# EAGLE board FIRSTPRINT (EAGLE 9.6.2)
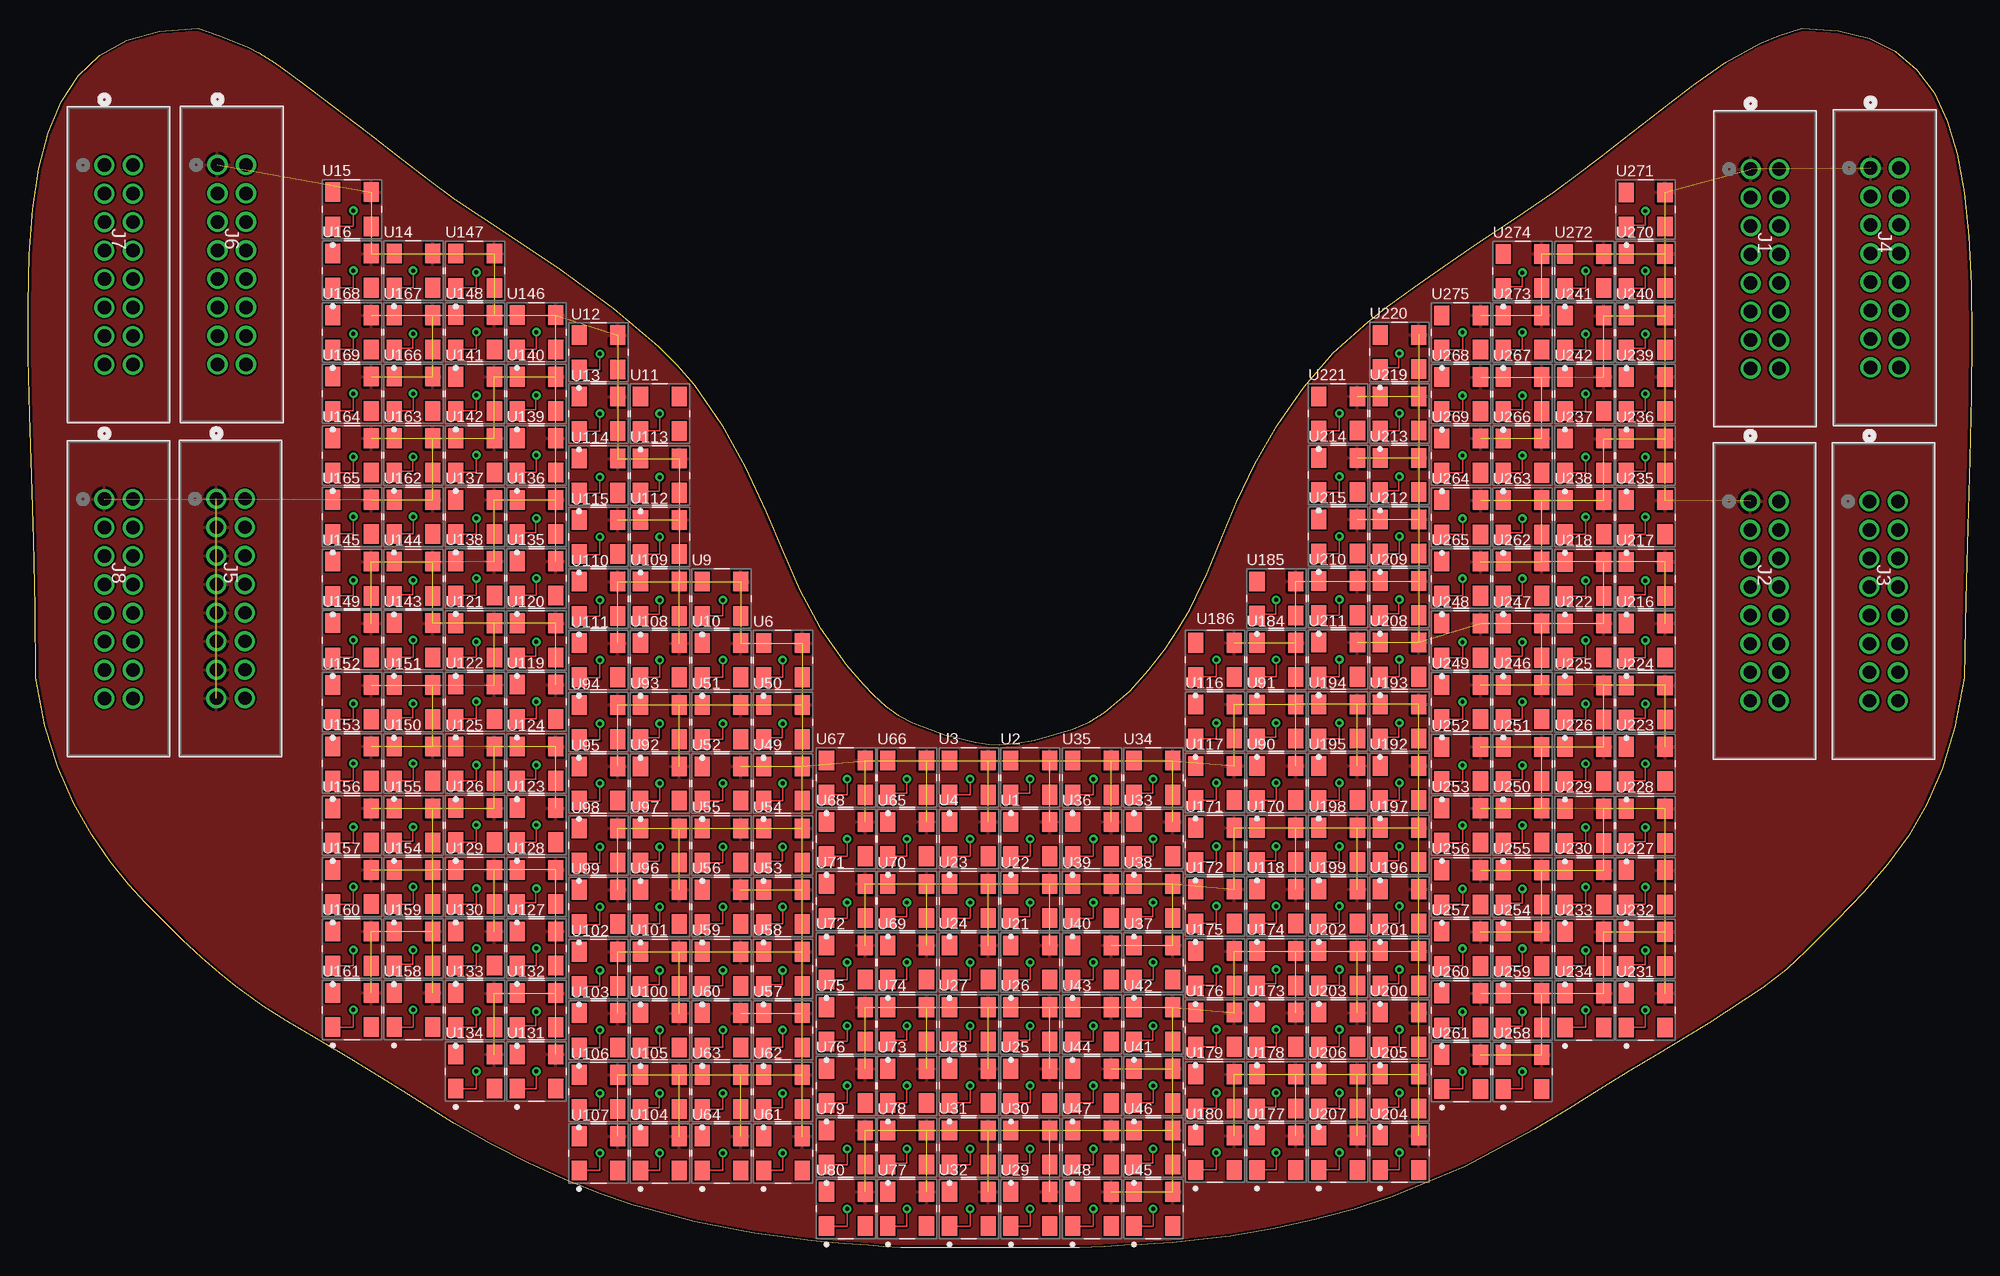
[diagram p9: board, top side]
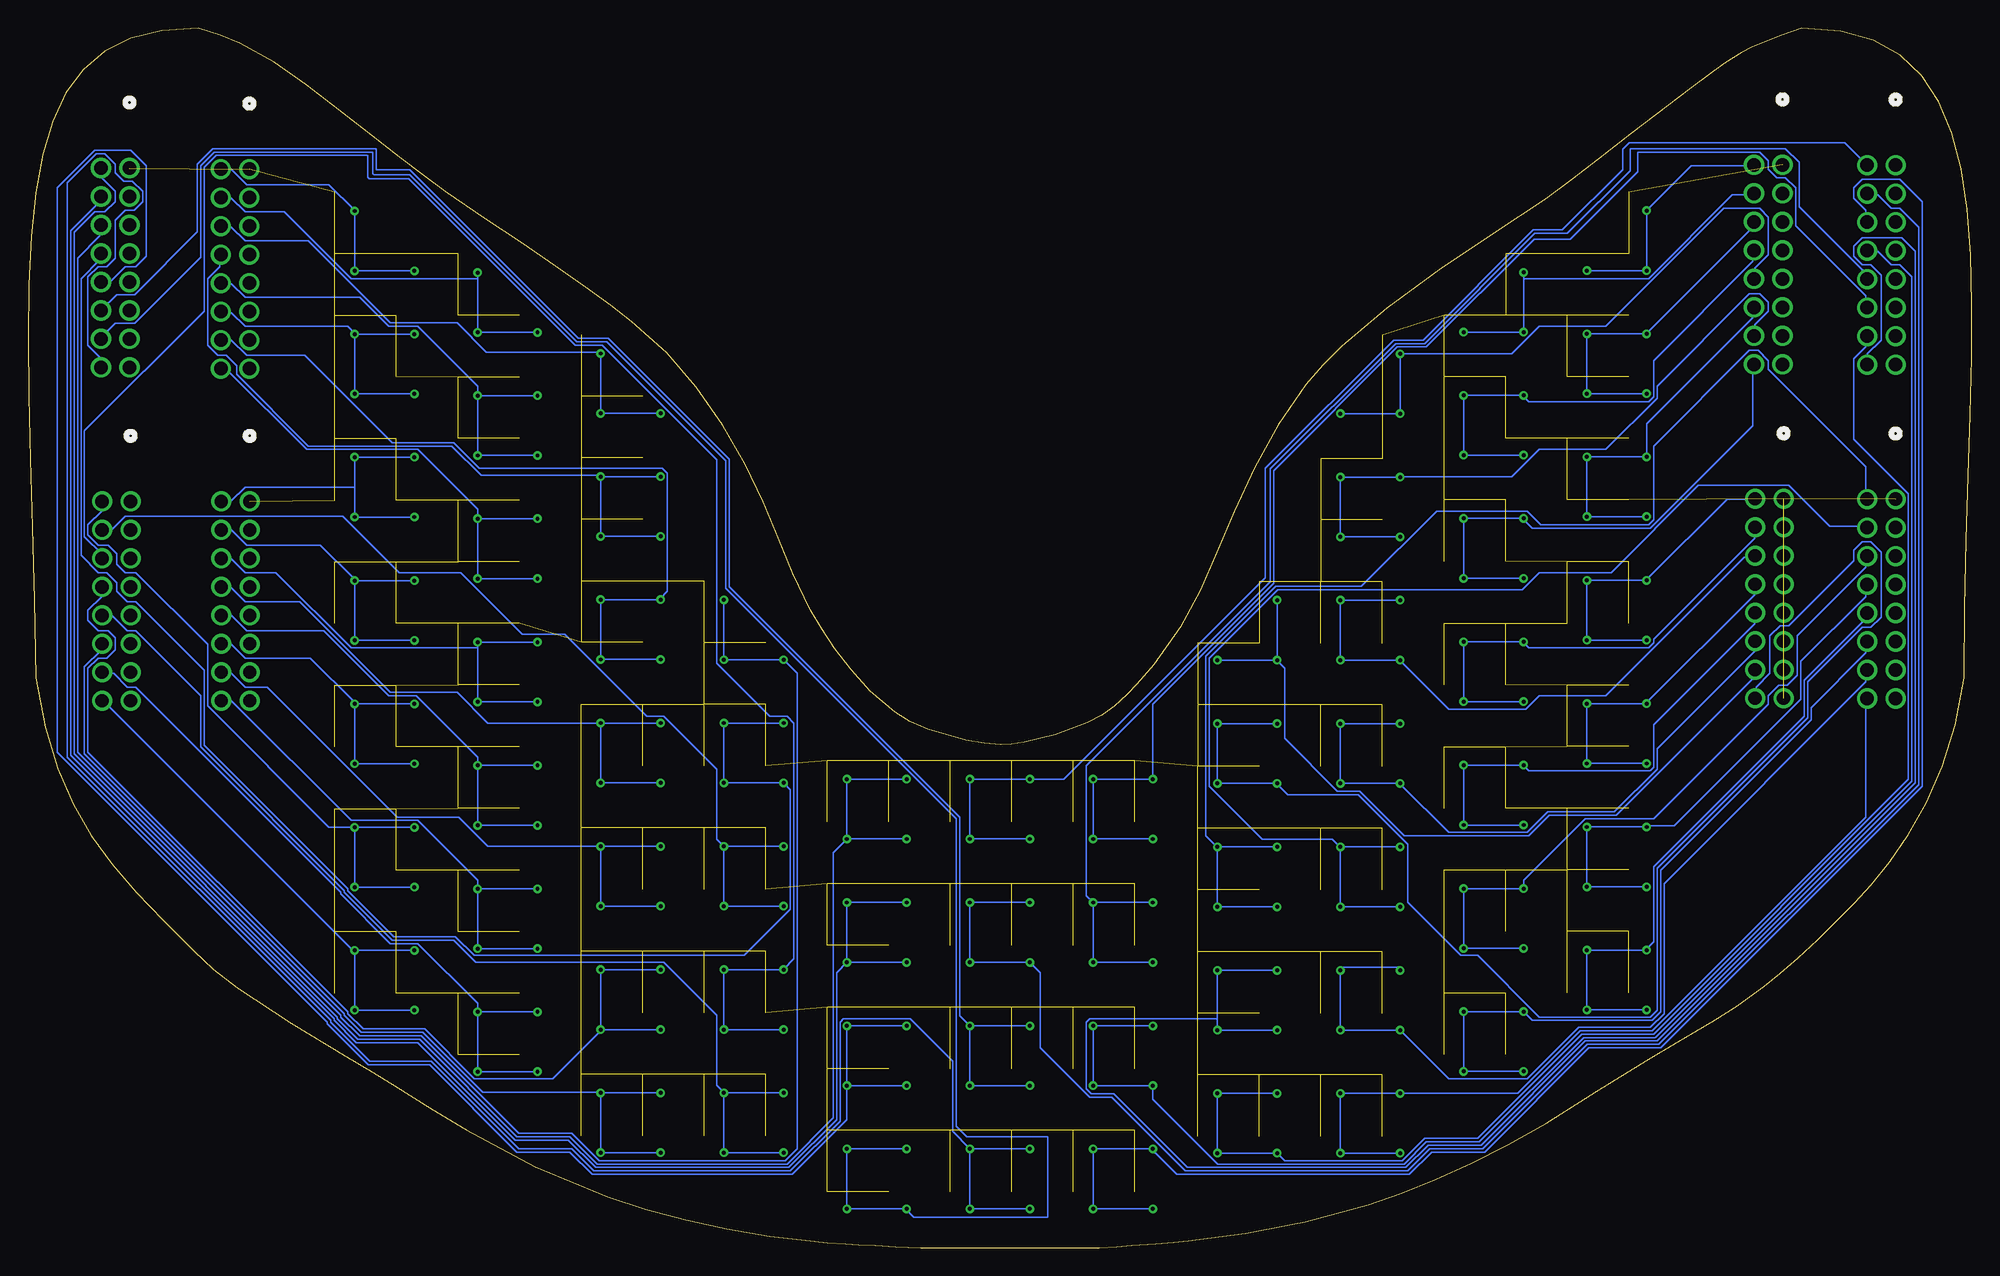
[diagram p10: board, bottom side, seen from below]

Size 173.3 x 108.74 mm. Coordinates in mm from the lower left corner, seen from the top.
Outline: 15.17,108.74 16.97,108.11 18.44,107.54 19.62,107.01 20.57,106.53 22,105.64 23.12,104.83 25.19,103.29 27.09,101.86 30.41,99.3 33.25,97.09 35.75,95.17 38.06,93.47 42.64,90.45 47.51,87.19 52.19,83.75 56.18,80.36 57.89,78.66 59.38,76.94 61.85,73.39 63.93,69.59 65.78,65.67 67.33,62.02 68.82,58.62 70.58,55.33 72.93,51.98 74.45,50.23 75.36,49.3 76.47,48.28 77.58,47.49 78.87,46.8 81.73,45.72 84.49,45.07 85.66,44.9 86.6,44.85 88.06,44.96 89.7,45.24 93.09,46.22 94.64,46.91 96,47.73 98.2,49.6 99.93,51.55 101.36,53.4 102.56,55.18 103.55,56.88 105.11,60.14 106.41,63.31 107.76,66.51 109.37,69.84 111.36,73.31 113.71,76.71 116.37,79.8 119.46,82.57 121.35,84.02 123.6,85.65 126.26,87.53 129.28,89.6 132.54,91.75 136.06,94.14 138,95.56 140.14,97.21 142.64,99.16 145.6,101.46 148.52,103.69 151.36,105.68 154.45,107.37 156.19,108.1 158.11,108.74 161.38,108.51 164.15,107.82 166.48,106.66 168.39,105.05 169.92,102.98 171.12,100.45 172.01,97.48 172.63,94.06 173.03,90.19 173.24,85.87 173.3,81.12 173.25,75.92 173.11,70.29 172.94,64.23 172.77,57.73 172.63,50.8 171.75,46.42 170.63,42.72 169.28,39.54 167.68,36.75 165.81,34.19 163.67,31.72 161.24,29.2 158.51,26.48 156.77,24.84 154.67,23.2 149.83,20.01 144.96,17.09 142.79,15.78 140.82,14.56 137.34,12.4 134.22,10.51 128.07,7.25 121.61,4.57 118.21,3.45 114.69,2.5 111.02,1.69 107.19,1.05 103.18,0.57 102.06,0.47 100.41,0.36 99.25,0.29 97.79,0.21 95.95,0.11 93.7,0 77.82,0 76.25,0.11 74.91,0.21 72.77,0.37 71.17,0.51 69.85,0.64 64.76,1.28 59.44,2.3 53.82,3.85 50.87,4.88 47.82,6.1 44.66,7.53 41.38,9.2 37.97,11.12 34.42,13.31 33.45,13.94 32.28,14.68 30.79,15.61 28.83,16.8 26.28,18.32 24.74,19.22 23,20.24 20.96,21.53 18.51,23.33 17.08,24.49 15.5,25.86 13.75,27.48 11.82,29.37 10.49,30.71 8.96,32.38 7.32,34.41 5.66,36.81 4.08,39.62 2.66,42.88 1.5,46.59 0.7,50.8 0.64,57.08 0.5,63.09 0.32,68.82 0.15,74.25 0.02,79.36 0,84.13 0.12,88.54 0.43,92.57 0.97,96.2 1.79,99.41 2.94,102.18 4.46,104.49 6.4,106.32 8.8,107.65 11.7,108.47 15.17,108.74
Copper layers (1*16): Top 0.035mm / dielectric 1.5mm / Bottom 0.035mm
Design rules "default *": minimum track width 6mil, minimum drill 0.35mm, track to track 6mil, track to pad 6mil, pad to pad 6mil, via to via 6mil, smd to smd 6mil, copper to edge 10mil, drill to drill 6mil, minimum pad ring 10mil, minimum via ring 8mil, stop-mask expansion 4mil, vias tented up to drill 0mil, thermal gap 10mil

## Footprints (pad centres in the part's own frame; a part is rotated, then mirrored left to right if it is on the bottom)
CONN_70246-1201_MOL = drill 1.194 pad 1.702: 1 0,0; 2 0,2.54; 3 2.54,0; 4 2.54,2.54; 5 5.08,0; 6 5.08,2.54; 7 7.62,0; 8 7.62,2.54; 9 10.16,0; 10 10.16,2.54; 11 12.7,0; 12 12.7,2.54; 13 15.24,0; 14 15.24,2.54; 15 17.78,0; 16 17.78,2.54
MURATA_MA40H1S-R_0 = smd 1.35 x 1.75: 1 -1.725,-1.525; 2 1.725,-1.525; 3 1.725,1.525; 4 -1.725,1.525

## Placement (x,y rotation side)
J1  70246-1201  [CONN_70246-1201_MOL]  153.57,96.16 270 top
J2  70246-1201  [CONN_70246-1201_MOL]  153.54,66.55 270 top
J3  70246-1201  [CONN_70246-1201_MOL]  164.16,66.55 270 top
J4  70246-1201  [CONN_70246-1201_MOL]  164.26,96.27 270 top
J5  70246-1201  [CONN_70246-1201_MOL]  16.79,66.78 270 top
J6  70246-1201  [CONN_70246-1201_MOL]  16.89,96.55 270 top
J7  70246-1201  [CONN_70246-1201_MOL]  6.8,96.52 270 top
J8  70246-1201  [CONN_70246-1201_MOL]  6.8,66.75 270 top
U1  MURATA_MA40H1S-RMURATA_MA40H1S-R_0_0  [MURATA_MA40H1S-R_0]  89.35,36.44 0 top
U2  MURATA_MA40H1S-RMURATA_MA40H1S-R_0_0  [MURATA_MA40H1S-R_0]  89.35,41.92 0 top
U3  MURATA_MA40H1S-RMURATA_MA40H1S-R_0_0  [MURATA_MA40H1S-R_0]  83.88,41.92 0 top
U4  MURATA_MA40H1S-RMURATA_MA40H1S-R_0_0  [MURATA_MA40H1S-R_0]  83.88,36.44 0 top
U6  MURATA_MA40H1S-RMURATA_MA40H1S-R_0_0  [MURATA_MA40H1S-R_0]  67.3,52.39 0 top
U9  MURATA_MA40H1S-RMURATA_MA40H1S-R_0_0  [MURATA_MA40H1S-R_0]  61.83,57.87 0 top
U10  MURATA_MA40H1S-RMURATA_MA40H1S-R_0_0  [MURATA_MA40H1S-R_0]  61.83,52.39 0 top
U11  MURATA_MA40H1S-RMURATA_MA40H1S-R_0_0  [MURATA_MA40H1S-R_0]  56.33,74.36 0 top
U12  MURATA_MA40H1S-RMURATA_MA40H1S-R_0_0  [MURATA_MA40H1S-R_0]  50.86,79.84 0 top
U13  MURATA_MA40H1S-RMURATA_MA40H1S-R_0_0  [MURATA_MA40H1S-R_0]  50.86,74.36 0 top
U14  MURATA_MA40H1S-RMURATA_MA40H1S-R_0_0  [MURATA_MA40H1S-R_0]  34.36,87.11 0 top
U15  MURATA_MA40H1S-RMURATA_MA40H1S-R_0_0  [MURATA_MA40H1S-R_0]  28.89,92.59 0 top
U16  MURATA_MA40H1S-RMURATA_MA40H1S-R_0_0  [MURATA_MA40H1S-R_0]  28.89,87.11 0 top
U21  MURATA_MA40H1S-RMURATA_MA40H1S-R_0_0  [MURATA_MA40H1S-R_0]  89.35,25.44 0 top
U22  MURATA_MA40H1S-RMURATA_MA40H1S-R_0_0  [MURATA_MA40H1S-R_0]  89.35,30.92 0 top
U23  MURATA_MA40H1S-RMURATA_MA40H1S-R_0_0  [MURATA_MA40H1S-R_0]  83.88,30.92 0 top
U24  MURATA_MA40H1S-RMURATA_MA40H1S-R_0_0  [MURATA_MA40H1S-R_0]  83.88,25.44 0 top
U25  MURATA_MA40H1S-RMURATA_MA40H1S-R_0_0  [MURATA_MA40H1S-R_0]  89.35,14.44 0 top
U26  MURATA_MA40H1S-RMURATA_MA40H1S-R_0_0  [MURATA_MA40H1S-R_0]  89.35,19.92 0 top
U27  MURATA_MA40H1S-RMURATA_MA40H1S-R_0_0  [MURATA_MA40H1S-R_0]  83.88,19.92 0 top
U28  MURATA_MA40H1S-RMURATA_MA40H1S-R_0_0  [MURATA_MA40H1S-R_0]  83.88,14.44 0 top
U29  MURATA_MA40H1S-RMURATA_MA40H1S-R_0_0  [MURATA_MA40H1S-R_0]  89.35,3.47 0 top
U30  MURATA_MA40H1S-RMURATA_MA40H1S-R_0_0  [MURATA_MA40H1S-R_0]  89.35,8.95 0 top
U31  MURATA_MA40H1S-RMURATA_MA40H1S-R_0_0  [MURATA_MA40H1S-R_0]  83.88,8.95 0 top
U32  MURATA_MA40H1S-RMURATA_MA40H1S-R_0_0  [MURATA_MA40H1S-R_0]  83.88,3.47 0 top
U33  MURATA_MA40H1S-RMURATA_MA40H1S-R_0_0  [MURATA_MA40H1S-R_0]  100.32,36.44 0 top
U34  MURATA_MA40H1S-RMURATA_MA40H1S-R_0_0  [MURATA_MA40H1S-R_0]  100.32,41.92 0 top
U35  MURATA_MA40H1S-RMURATA_MA40H1S-R_0_0  [MURATA_MA40H1S-R_0]  94.85,41.92 0 top
U36  MURATA_MA40H1S-RMURATA_MA40H1S-R_0_0  [MURATA_MA40H1S-R_0]  94.85,36.44 0 top
U37  MURATA_MA40H1S-RMURATA_MA40H1S-R_0_0  [MURATA_MA40H1S-R_0]  100.32,25.44 0 top
U38  MURATA_MA40H1S-RMURATA_MA40H1S-R_0_0  [MURATA_MA40H1S-R_0]  100.32,30.92 0 top
U39  MURATA_MA40H1S-RMURATA_MA40H1S-R_0_0  [MURATA_MA40H1S-R_0]  94.85,30.92 0 top
U40  MURATA_MA40H1S-RMURATA_MA40H1S-R_0_0  [MURATA_MA40H1S-R_0]  94.85,25.44 0 top
U41  MURATA_MA40H1S-RMURATA_MA40H1S-R_0_0  [MURATA_MA40H1S-R_0]  100.32,14.44 0 top
U42  MURATA_MA40H1S-RMURATA_MA40H1S-R_0_0  [MURATA_MA40H1S-R_0]  100.32,19.92 0 top
U43  MURATA_MA40H1S-RMURATA_MA40H1S-R_0_0  [MURATA_MA40H1S-R_0]  94.85,19.92 0 top
U44  MURATA_MA40H1S-RMURATA_MA40H1S-R_0_0  [MURATA_MA40H1S-R_0]  94.85,14.44 0 top
U45  MURATA_MA40H1S-RMURATA_MA40H1S-R_0_0  [MURATA_MA40H1S-R_0]  100.32,3.47 0 top
U46  MURATA_MA40H1S-RMURATA_MA40H1S-R_0_0  [MURATA_MA40H1S-R_0]  100.32,8.95 0 top
U47  MURATA_MA40H1S-RMURATA_MA40H1S-R_0_0  [MURATA_MA40H1S-R_0]  94.85,8.95 0 top
U48  MURATA_MA40H1S-RMURATA_MA40H1S-R_0_0  [MURATA_MA40H1S-R_0]  94.85,3.47 0 top
U49  MURATA_MA40H1S-RMURATA_MA40H1S-R_0_0  [MURATA_MA40H1S-R_0]  67.3,41.39 0 top
U50  MURATA_MA40H1S-RMURATA_MA40H1S-R_0_0  [MURATA_MA40H1S-R_0]  67.3,46.87 0 top
U51  MURATA_MA40H1S-RMURATA_MA40H1S-R_0_0  [MURATA_MA40H1S-R_0]  61.83,46.87 0 top
U52  MURATA_MA40H1S-RMURATA_MA40H1S-R_0_0  [MURATA_MA40H1S-R_0]  61.83,41.39 0 top
U53  MURATA_MA40H1S-RMURATA_MA40H1S-R_0_0  [MURATA_MA40H1S-R_0]  67.3,30.39 0 top
U54  MURATA_MA40H1S-RMURATA_MA40H1S-R_0_0  [MURATA_MA40H1S-R_0]  67.3,35.87 0 top
U55  MURATA_MA40H1S-RMURATA_MA40H1S-R_0_0  [MURATA_MA40H1S-R_0]  61.83,35.87 0 top
U56  MURATA_MA40H1S-RMURATA_MA40H1S-R_0_0  [MURATA_MA40H1S-R_0]  61.83,30.39 0 top
U57  MURATA_MA40H1S-RMURATA_MA40H1S-R_0_0  [MURATA_MA40H1S-R_0]  67.3,19.4 0 top
U58  MURATA_MA40H1S-RMURATA_MA40H1S-R_0_0  [MURATA_MA40H1S-R_0]  67.3,24.87 0 top
U59  MURATA_MA40H1S-RMURATA_MA40H1S-R_0_0  [MURATA_MA40H1S-R_0]  61.83,24.87 0 top
U60  MURATA_MA40H1S-RMURATA_MA40H1S-R_0_0  [MURATA_MA40H1S-R_0]  61.83,19.4 0 top
U61  MURATA_MA40H1S-RMURATA_MA40H1S-R_0_0  [MURATA_MA40H1S-R_0]  67.3,8.42 0 top
U62  MURATA_MA40H1S-RMURATA_MA40H1S-R_0_0  [MURATA_MA40H1S-R_0]  67.3,13.9 0 top
U63  MURATA_MA40H1S-RMURATA_MA40H1S-R_0_0  [MURATA_MA40H1S-R_0]  61.83,13.9 0 top
U64  MURATA_MA40H1S-RMURATA_MA40H1S-R_0_0  [MURATA_MA40H1S-R_0]  61.83,8.42 0 top
U65  MURATA_MA40H1S-RMURATA_MA40H1S-R_0_0  [MURATA_MA40H1S-R_0]  78.38,36.44 0 top
U66  MURATA_MA40H1S-RMURATA_MA40H1S-R_0_0  [MURATA_MA40H1S-R_0]  78.38,41.92 0 top
U67  MURATA_MA40H1S-RMURATA_MA40H1S-R_0_0  [MURATA_MA40H1S-R_0]  72.9,41.92 0 top
U68  MURATA_MA40H1S-RMURATA_MA40H1S-R_0_0  [MURATA_MA40H1S-R_0]  72.9,36.44 0 top
U69  MURATA_MA40H1S-RMURATA_MA40H1S-R_0_0  [MURATA_MA40H1S-R_0]  78.38,25.44 0 top
U70  MURATA_MA40H1S-RMURATA_MA40H1S-R_0_0  [MURATA_MA40H1S-R_0]  78.38,30.92 0 top
U71  MURATA_MA40H1S-RMURATA_MA40H1S-R_0_0  [MURATA_MA40H1S-R_0]  72.9,30.92 0 top
U72  MURATA_MA40H1S-RMURATA_MA40H1S-R_0_0  [MURATA_MA40H1S-R_0]  72.9,25.44 0 top
U73  MURATA_MA40H1S-RMURATA_MA40H1S-R_0_0  [MURATA_MA40H1S-R_0]  78.38,14.44 0 top
U74  MURATA_MA40H1S-RMURATA_MA40H1S-R_0_0  [MURATA_MA40H1S-R_0]  78.38,19.92 0 top
U75  MURATA_MA40H1S-RMURATA_MA40H1S-R_0_0  [MURATA_MA40H1S-R_0]  72.9,19.92 0 top
U76  MURATA_MA40H1S-RMURATA_MA40H1S-R_0_0  [MURATA_MA40H1S-R_0]  72.9,14.44 0 top
U77  MURATA_MA40H1S-RMURATA_MA40H1S-R_0_0  [MURATA_MA40H1S-R_0]  78.38,3.47 0 top
U78  MURATA_MA40H1S-RMURATA_MA40H1S-R_0_0  [MURATA_MA40H1S-R_0]  78.38,8.95 0 top
U79  MURATA_MA40H1S-RMURATA_MA40H1S-R_0_0  [MURATA_MA40H1S-R_0]  72.9,8.95 0 top
U80  MURATA_MA40H1S-RMURATA_MA40H1S-R_0_0  [MURATA_MA40H1S-R_0]  72.9,3.47 0 top
U90  MURATA_MA40H1S-RMURATA_MA40H1S-R_0_0  [MURATA_MA40H1S-R_0]  111.29,41.44 0 top
U91  MURATA_MA40H1S-RMURATA_MA40H1S-R_0_0  [MURATA_MA40H1S-R_0]  111.29,46.92 0 top
U92  MURATA_MA40H1S-RMURATA_MA40H1S-R_0_0  [MURATA_MA40H1S-R_0]  56.33,41.39 0 top
U93  MURATA_MA40H1S-RMURATA_MA40H1S-R_0_0  [MURATA_MA40H1S-R_0]  56.33,46.87 0 top
U94  MURATA_MA40H1S-RMURATA_MA40H1S-R_0_0  [MURATA_MA40H1S-R_0]  50.86,46.87 0 top
U95  MURATA_MA40H1S-RMURATA_MA40H1S-R_0_0  [MURATA_MA40H1S-R_0]  50.86,41.39 0 top
U96  MURATA_MA40H1S-RMURATA_MA40H1S-R_0_0  [MURATA_MA40H1S-R_0]  56.33,30.39 0 top
U97  MURATA_MA40H1S-RMURATA_MA40H1S-R_0_0  [MURATA_MA40H1S-R_0]  56.33,35.87 0 top
U98  MURATA_MA40H1S-RMURATA_MA40H1S-R_0_0  [MURATA_MA40H1S-R_0]  50.86,35.87 0 top
U99  MURATA_MA40H1S-RMURATA_MA40H1S-R_0_0  [MURATA_MA40H1S-R_0]  50.86,30.39 0 top
U100  MURATA_MA40H1S-RMURATA_MA40H1S-R_0_0  [MURATA_MA40H1S-R_0]  56.33,19.4 0 top
U101  MURATA_MA40H1S-RMURATA_MA40H1S-R_0_0  [MURATA_MA40H1S-R_0]  56.33,24.87 0 top
U102  MURATA_MA40H1S-RMURATA_MA40H1S-R_0_0  [MURATA_MA40H1S-R_0]  50.86,24.87 0 top
U103  MURATA_MA40H1S-RMURATA_MA40H1S-R_0_0  [MURATA_MA40H1S-R_0]  50.86,19.4 0 top
U104  MURATA_MA40H1S-RMURATA_MA40H1S-R_0_0  [MURATA_MA40H1S-R_0]  56.33,8.42 0 top
U105  MURATA_MA40H1S-RMURATA_MA40H1S-R_0_0  [MURATA_MA40H1S-R_0]  56.33,13.9 0 top
U106  MURATA_MA40H1S-RMURATA_MA40H1S-R_0_0  [MURATA_MA40H1S-R_0]  50.86,13.9 0 top
U107  MURATA_MA40H1S-RMURATA_MA40H1S-R_0_0  [MURATA_MA40H1S-R_0]  50.86,8.42 0 top
U108  MURATA_MA40H1S-RMURATA_MA40H1S-R_0_0  [MURATA_MA40H1S-R_0]  56.33,52.39 0 top
U109  MURATA_MA40H1S-RMURATA_MA40H1S-R_0_0  [MURATA_MA40H1S-R_0]  56.33,57.87 0 top
U110  MURATA_MA40H1S-RMURATA_MA40H1S-R_0_0  [MURATA_MA40H1S-R_0]  50.86,57.87 0 top
U111  MURATA_MA40H1S-RMURATA_MA40H1S-R_0_0  [MURATA_MA40H1S-R_0]  50.86,52.39 0 top
U112  MURATA_MA40H1S-RMURATA_MA40H1S-R_0_0  [MURATA_MA40H1S-R_0]  56.33,63.36 0 top
U113  MURATA_MA40H1S-RMURATA_MA40H1S-R_0_0  [MURATA_MA40H1S-R_0]  56.33,68.84 0 top
U114  MURATA_MA40H1S-RMURATA_MA40H1S-R_0_0  [MURATA_MA40H1S-R_0]  50.86,68.84 0 top
U115  MURATA_MA40H1S-RMURATA_MA40H1S-R_0_0  [MURATA_MA40H1S-R_0]  50.86,63.36 0 top
U116  MURATA_MA40H1S-RMURATA_MA40H1S-R_0_0  [MURATA_MA40H1S-R_0]  105.82,46.92 0 top
U117  MURATA_MA40H1S-RMURATA_MA40H1S-R_0_0  [MURATA_MA40H1S-R_0]  105.82,41.44 0 top
U118  MURATA_MA40H1S-RMURATA_MA40H1S-R_0_0  [MURATA_MA40H1S-R_0]  111.29,30.44 0 top
U119  MURATA_MA40H1S-RMURATA_MA40H1S-R_0_0  [MURATA_MA40H1S-R_0]  45.33,48.68 0 top
U120  MURATA_MA40H1S-RMURATA_MA40H1S-R_0_0  [MURATA_MA40H1S-R_0]  45.33,54.16 0 top
U121  MURATA_MA40H1S-RMURATA_MA40H1S-R_0_0  [MURATA_MA40H1S-R_0]  39.86,54.16 0 top
U122  MURATA_MA40H1S-RMURATA_MA40H1S-R_0_0  [MURATA_MA40H1S-R_0]  39.86,48.68 0 top
U123  MURATA_MA40H1S-RMURATA_MA40H1S-R_0_0  [MURATA_MA40H1S-R_0]  45.33,37.68 0 top
U124  MURATA_MA40H1S-RMURATA_MA40H1S-R_0_0  [MURATA_MA40H1S-R_0]  45.33,43.16 0 top
U125  MURATA_MA40H1S-RMURATA_MA40H1S-R_0_0  [MURATA_MA40H1S-R_0]  39.86,43.16 0 top
U126  MURATA_MA40H1S-RMURATA_MA40H1S-R_0_0  [MURATA_MA40H1S-R_0]  39.86,37.68 0 top
U127  MURATA_MA40H1S-RMURATA_MA40H1S-R_0_0  [MURATA_MA40H1S-R_0]  45.33,26.68 0 top
U128  MURATA_MA40H1S-RMURATA_MA40H1S-R_0_0  [MURATA_MA40H1S-R_0]  45.33,32.16 0 top
U129  MURATA_MA40H1S-RMURATA_MA40H1S-R_0_0  [MURATA_MA40H1S-R_0]  39.86,32.16 0 top
U130  MURATA_MA40H1S-RMURATA_MA40H1S-R_0_0  [MURATA_MA40H1S-R_0]  39.86,26.68 0 top
U131  MURATA_MA40H1S-RMURATA_MA40H1S-R_0_0  [MURATA_MA40H1S-R_0]  45.33,15.71 0 top
U132  MURATA_MA40H1S-RMURATA_MA40H1S-R_0_0  [MURATA_MA40H1S-R_0]  45.33,21.19 0 top
U133  MURATA_MA40H1S-RMURATA_MA40H1S-R_0_0  [MURATA_MA40H1S-R_0]  39.86,21.19 0 top
U134  MURATA_MA40H1S-RMURATA_MA40H1S-R_0_0  [MURATA_MA40H1S-R_0]  39.86,15.71 0 top
U135  MURATA_MA40H1S-RMURATA_MA40H1S-R_0_0  [MURATA_MA40H1S-R_0]  45.33,59.68 0 top
U136  MURATA_MA40H1S-RMURATA_MA40H1S-R_0_0  [MURATA_MA40H1S-R_0]  45.33,65.16 0 top
U137  MURATA_MA40H1S-RMURATA_MA40H1S-R_0_0  [MURATA_MA40H1S-R_0]  39.86,65.16 0 top
U138  MURATA_MA40H1S-RMURATA_MA40H1S-R_0_0  [MURATA_MA40H1S-R_0]  39.86,59.68 0 top
U139  MURATA_MA40H1S-RMURATA_MA40H1S-R_0_0  [MURATA_MA40H1S-R_0]  45.33,70.65 0 top
U140  MURATA_MA40H1S-RMURATA_MA40H1S-R_0_0  [MURATA_MA40H1S-R_0]  45.33,76.13 0 top
U141  MURATA_MA40H1S-RMURATA_MA40H1S-R_0_0  [MURATA_MA40H1S-R_0]  39.86,76.13 0 top
U142  MURATA_MA40H1S-RMURATA_MA40H1S-R_0_0  [MURATA_MA40H1S-R_0]  39.86,70.65 0 top
U143  MURATA_MA40H1S-RMURATA_MA40H1S-R_0_0  [MURATA_MA40H1S-R_0]  34.36,54.17 0 top
U144  MURATA_MA40H1S-RMURATA_MA40H1S-R_0_0  [MURATA_MA40H1S-R_0]  34.36,59.65 0 top
U145  MURATA_MA40H1S-RMURATA_MA40H1S-R_0_0  [MURATA_MA40H1S-R_0]  28.89,59.65 0 top
U146  MURATA_MA40H1S-RMURATA_MA40H1S-R_0_0  [MURATA_MA40H1S-R_0]  45.33,81.63 0 top
U147  MURATA_MA40H1S-RMURATA_MA40H1S-R_0_0  [MURATA_MA40H1S-R_0]  39.86,87.1 0 top
U148  MURATA_MA40H1S-RMURATA_MA40H1S-R_0_0  [MURATA_MA40H1S-R_0]  39.86,81.63 0 top
U149  MURATA_MA40H1S-RMURATA_MA40H1S-R_0_0  [MURATA_MA40H1S-R_0]  28.89,54.17 0 top
U150  MURATA_MA40H1S-RMURATA_MA40H1S-R_0_0  [MURATA_MA40H1S-R_0]  34.36,43.17 0 top
U151  MURATA_MA40H1S-RMURATA_MA40H1S-R_0_0  [MURATA_MA40H1S-R_0]  34.36,48.65 0 top
U152  MURATA_MA40H1S-RMURATA_MA40H1S-R_0_0  [MURATA_MA40H1S-R_0]  28.89,48.65 0 top
U153  MURATA_MA40H1S-RMURATA_MA40H1S-R_0_0  [MURATA_MA40H1S-R_0]  28.89,43.17 0 top
U154  MURATA_MA40H1S-RMURATA_MA40H1S-R_0_0  [MURATA_MA40H1S-R_0]  34.36,32.17 0 top
U155  MURATA_MA40H1S-RMURATA_MA40H1S-R_0_0  [MURATA_MA40H1S-R_0]  34.36,37.65 0 top
U156  MURATA_MA40H1S-RMURATA_MA40H1S-R_0_0  [MURATA_MA40H1S-R_0]  28.89,37.65 0 top
U157  MURATA_MA40H1S-RMURATA_MA40H1S-R_0_0  [MURATA_MA40H1S-R_0]  28.89,32.17 0 top
U158  MURATA_MA40H1S-RMURATA_MA40H1S-R_0_0  [MURATA_MA40H1S-R_0]  34.36,21.2 0 top
U159  MURATA_MA40H1S-RMURATA_MA40H1S-R_0_0  [MURATA_MA40H1S-R_0]  34.36,26.68 0 top
U160  MURATA_MA40H1S-RMURATA_MA40H1S-R_0_0  [MURATA_MA40H1S-R_0]  28.89,26.68 0 top
U161  MURATA_MA40H1S-RMURATA_MA40H1S-R_0_0  [MURATA_MA40H1S-R_0]  28.89,21.2 0 top
U162  MURATA_MA40H1S-RMURATA_MA40H1S-R_0_0  [MURATA_MA40H1S-R_0]  34.36,65.17 0 top
U163  MURATA_MA40H1S-RMURATA_MA40H1S-R_0_0  [MURATA_MA40H1S-R_0]  34.36,70.64 0 top
U164  MURATA_MA40H1S-RMURATA_MA40H1S-R_0_0  [MURATA_MA40H1S-R_0]  28.89,70.64 0 top
U165  MURATA_MA40H1S-RMURATA_MA40H1S-R_0_0  [MURATA_MA40H1S-R_0]  28.89,65.17 0 top
U166  MURATA_MA40H1S-RMURATA_MA40H1S-R_0_0  [MURATA_MA40H1S-R_0]  34.36,76.14 0 top
U167  MURATA_MA40H1S-RMURATA_MA40H1S-R_0_0  [MURATA_MA40H1S-R_0]  34.36,81.62 0 top
U168  MURATA_MA40H1S-RMURATA_MA40H1S-R_0_0  [MURATA_MA40H1S-R_0]  28.89,81.62 0 top
U169  MURATA_MA40H1S-RMURATA_MA40H1S-R_0_0  [MURATA_MA40H1S-R_0]  28.89,76.14 0 top
U170  MURATA_MA40H1S-RMURATA_MA40H1S-R_0_0  [MURATA_MA40H1S-R_0]  111.29,35.92 0 top
U171  MURATA_MA40H1S-RMURATA_MA40H1S-R_0_0  [MURATA_MA40H1S-R_0]  105.82,35.92 0 top
U172  MURATA_MA40H1S-RMURATA_MA40H1S-R_0_0  [MURATA_MA40H1S-R_0]  105.82,30.44 0 top
U173  MURATA_MA40H1S-RMURATA_MA40H1S-R_0_0  [MURATA_MA40H1S-R_0]  111.29,19.45 0 top
U174  MURATA_MA40H1S-RMURATA_MA40H1S-R_0_0  [MURATA_MA40H1S-R_0]  111.29,24.92 0 top
U175  MURATA_MA40H1S-RMURATA_MA40H1S-R_0_0  [MURATA_MA40H1S-R_0]  105.82,24.92 0 top
U176  MURATA_MA40H1S-RMURATA_MA40H1S-R_0_0  [MURATA_MA40H1S-R_0]  105.82,19.45 0 top
U177  MURATA_MA40H1S-RMURATA_MA40H1S-R_0_0  [MURATA_MA40H1S-R_0]  111.29,8.47 0 top
U178  MURATA_MA40H1S-RMURATA_MA40H1S-R_0_0  [MURATA_MA40H1S-R_0]  111.29,13.95 0 top
U179  MURATA_MA40H1S-RMURATA_MA40H1S-R_0_0  [MURATA_MA40H1S-R_0]  105.82,13.95 0 top
U180  MURATA_MA40H1S-RMURATA_MA40H1S-R_0_0  [MURATA_MA40H1S-R_0]  105.82,8.47 0 top
U184  MURATA_MA40H1S-RMURATA_MA40H1S-R_0_0  [MURATA_MA40H1S-R_0]  111.29,52.42 0 top
U185  MURATA_MA40H1S-RMURATA_MA40H1S-R_0_0  [MURATA_MA40H1S-R_0]  111.29,57.89 0 top
U186  MURATA_MA40H1S-RMURATA_MA40H1S-R_0_0  [MURATA_MA40H1S-R_0]  105.82,52.42 0 top
U192  MURATA_MA40H1S-RMURATA_MA40H1S-R_0_0  [MURATA_MA40H1S-R_0]  122.27,41.44 0 top
U193  MURATA_MA40H1S-RMURATA_MA40H1S-R_0_0  [MURATA_MA40H1S-R_0]  122.27,46.92 0 top
U194  MURATA_MA40H1S-RMURATA_MA40H1S-R_0_0  [MURATA_MA40H1S-R_0]  116.79,46.92 0 top
U195  MURATA_MA40H1S-RMURATA_MA40H1S-R_0_0  [MURATA_MA40H1S-R_0]  116.79,41.44 0 top
U196  MURATA_MA40H1S-RMURATA_MA40H1S-R_0_0  [MURATA_MA40H1S-R_0]  122.27,30.44 0 top
U197  MURATA_MA40H1S-RMURATA_MA40H1S-R_0_0  [MURATA_MA40H1S-R_0]  122.27,35.92 0 top
U198  MURATA_MA40H1S-RMURATA_MA40H1S-R_0_0  [MURATA_MA40H1S-R_0]  116.79,35.92 0 top
U199  MURATA_MA40H1S-RMURATA_MA40H1S-R_0_0  [MURATA_MA40H1S-R_0]  116.79,30.44 0 top
U200  MURATA_MA40H1S-RMURATA_MA40H1S-R_0_0  [MURATA_MA40H1S-R_0]  122.27,19.45 0 top
U201  MURATA_MA40H1S-RMURATA_MA40H1S-R_0_0  [MURATA_MA40H1S-R_0]  122.27,24.92 0 top
U202  MURATA_MA40H1S-RMURATA_MA40H1S-R_0_0  [MURATA_MA40H1S-R_0]  116.79,24.92 0 top
U203  MURATA_MA40H1S-RMURATA_MA40H1S-R_0_0  [MURATA_MA40H1S-R_0]  116.79,19.45 0 top
U204  MURATA_MA40H1S-RMURATA_MA40H1S-R_0_0  [MURATA_MA40H1S-R_0]  122.27,8.47 0 top
U205  MURATA_MA40H1S-RMURATA_MA40H1S-R_0_0  [MURATA_MA40H1S-R_0]  122.27,13.95 0 top
U206  MURATA_MA40H1S-RMURATA_MA40H1S-R_0_0  [MURATA_MA40H1S-R_0]  116.79,13.95 0 top
U207  MURATA_MA40H1S-RMURATA_MA40H1S-R_0_0  [MURATA_MA40H1S-R_0]  116.79,8.47 0 top
U208  MURATA_MA40H1S-RMURATA_MA40H1S-R_0_0  [MURATA_MA40H1S-R_0]  122.27,52.44 0 top
U209  MURATA_MA40H1S-RMURATA_MA40H1S-R_0_0  [MURATA_MA40H1S-R_0]  122.27,57.92 0 top
U210  MURATA_MA40H1S-RMURATA_MA40H1S-R_0_0  [MURATA_MA40H1S-R_0]  116.79,57.92 0 top
U211  MURATA_MA40H1S-RMURATA_MA40H1S-R_0_0  [MURATA_MA40H1S-R_0]  116.79,52.44 0 top
U212  MURATA_MA40H1S-RMURATA_MA40H1S-R_0_0  [MURATA_MA40H1S-R_0]  122.27,63.41 0 top
U213  MURATA_MA40H1S-RMURATA_MA40H1S-R_0_0  [MURATA_MA40H1S-R_0]  122.27,68.89 0 top
U214  MURATA_MA40H1S-RMURATA_MA40H1S-R_0_0  [MURATA_MA40H1S-R_0]  116.79,68.89 0 top
U215  MURATA_MA40H1S-RMURATA_MA40H1S-R_0_0  [MURATA_MA40H1S-R_0]  116.79,63.41 0 top
U216  MURATA_MA40H1S-RMURATA_MA40H1S-R_0_0  [MURATA_MA40H1S-R_0]  144.21,54.14 0 top
U217  MURATA_MA40H1S-RMURATA_MA40H1S-R_0_0  [MURATA_MA40H1S-R_0]  144.21,59.62 0 top
U218  MURATA_MA40H1S-RMURATA_MA40H1S-R_0_0  [MURATA_MA40H1S-R_0]  138.74,59.62 0 top
U219  MURATA_MA40H1S-RMURATA_MA40H1S-R_0_0  [MURATA_MA40H1S-R_0]  122.27,74.39 0 top
U220  MURATA_MA40H1S-RMURATA_MA40H1S-R_0_0  [MURATA_MA40H1S-R_0]  122.27,79.86 0 top
U221  MURATA_MA40H1S-RMURATA_MA40H1S-R_0_0  [MURATA_MA40H1S-R_0]  116.79,74.39 0 top
U222  MURATA_MA40H1S-RMURATA_MA40H1S-R_0_0  [MURATA_MA40H1S-R_0]  138.74,54.14 0 top
U223  MURATA_MA40H1S-RMURATA_MA40H1S-R_0_0  [MURATA_MA40H1S-R_0]  144.21,43.14 0 top
U224  MURATA_MA40H1S-RMURATA_MA40H1S-R_0_0  [MURATA_MA40H1S-R_0]  144.21,48.62 0 top
U225  MURATA_MA40H1S-RMURATA_MA40H1S-R_0_0  [MURATA_MA40H1S-R_0]  138.74,48.62 0 top
U226  MURATA_MA40H1S-RMURATA_MA40H1S-R_0_0  [MURATA_MA40H1S-R_0]  138.74,43.14 0 top
U227  MURATA_MA40H1S-RMURATA_MA40H1S-R_0_0  [MURATA_MA40H1S-R_0]  144.21,32.15 0 top
U228  MURATA_MA40H1S-RMURATA_MA40H1S-R_0_0  [MURATA_MA40H1S-R_0]  144.21,37.62 0 top
U229  MURATA_MA40H1S-RMURATA_MA40H1S-R_0_0  [MURATA_MA40H1S-R_0]  138.74,37.62 0 top
U230  MURATA_MA40H1S-RMURATA_MA40H1S-R_0_0  [MURATA_MA40H1S-R_0]  138.74,32.15 0 top
U231  MURATA_MA40H1S-RMURATA_MA40H1S-R_0_0  [MURATA_MA40H1S-R_0]  144.21,21.17 0 top
U232  MURATA_MA40H1S-RMURATA_MA40H1S-R_0_0  [MURATA_MA40H1S-R_0]  144.21,26.65 0 top
U233  MURATA_MA40H1S-RMURATA_MA40H1S-R_0_0  [MURATA_MA40H1S-R_0]  138.74,26.65 0 top
U234  MURATA_MA40H1S-RMURATA_MA40H1S-R_0_0  [MURATA_MA40H1S-R_0]  138.74,21.17 0 top
U235  MURATA_MA40H1S-RMURATA_MA40H1S-R_0_0  [MURATA_MA40H1S-R_0]  144.21,65.14 0 top
U236  MURATA_MA40H1S-RMURATA_MA40H1S-R_0_0  [MURATA_MA40H1S-R_0]  144.21,70.62 0 top
U237  MURATA_MA40H1S-RMURATA_MA40H1S-R_0_0  [MURATA_MA40H1S-R_0]  138.74,70.62 0 top
U238  MURATA_MA40H1S-RMURATA_MA40H1S-R_0_0  [MURATA_MA40H1S-R_0]  138.74,65.14 0 top
U239  MURATA_MA40H1S-RMURATA_MA40H1S-R_0_0  [MURATA_MA40H1S-R_0]  144.21,76.11 0 top
U240  MURATA_MA40H1S-RMURATA_MA40H1S-R_0_0  [MURATA_MA40H1S-R_0]  144.21,81.59 0 top
U241  MURATA_MA40H1S-RMURATA_MA40H1S-R_0_0  [MURATA_MA40H1S-R_0]  138.74,81.59 0 top
U242  MURATA_MA40H1S-RMURATA_MA40H1S-R_0_0  [MURATA_MA40H1S-R_0]  138.74,76.11 0 top
U246  MURATA_MA40H1S-RMURATA_MA40H1S-R_0_0  [MURATA_MA40H1S-R_0]  133.24,48.66 0 top
U247  MURATA_MA40H1S-RMURATA_MA40H1S-R_0_0  [MURATA_MA40H1S-R_0]  133.24,54.13 0 top
U248  MURATA_MA40H1S-RMURATA_MA40H1S-R_0_0  [MURATA_MA40H1S-R_0]  127.77,54.13 0 top
U249  MURATA_MA40H1S-RMURATA_MA40H1S-R_0_0  [MURATA_MA40H1S-R_0]  127.77,48.66 0 top
U250  MURATA_MA40H1S-RMURATA_MA40H1S-R_0_0  [MURATA_MA40H1S-R_0]  133.24,37.66 0 top
U251  MURATA_MA40H1S-RMURATA_MA40H1S-R_0_0  [MURATA_MA40H1S-R_0]  133.24,43.14 0 top
U252  MURATA_MA40H1S-RMURATA_MA40H1S-R_0_0  [MURATA_MA40H1S-R_0]  127.77,43.14 0 top
U253  MURATA_MA40H1S-RMURATA_MA40H1S-R_0_0  [MURATA_MA40H1S-R_0]  127.77,37.66 0 top
U254  MURATA_MA40H1S-RMURATA_MA40H1S-R_0_0  [MURATA_MA40H1S-R_0]  133.24,26.66 0 top
U255  MURATA_MA40H1S-RMURATA_MA40H1S-R_0_0  [MURATA_MA40H1S-R_0]  133.24,32.14 0 top
U256  MURATA_MA40H1S-RMURATA_MA40H1S-R_0_0  [MURATA_MA40H1S-R_0]  127.77,32.14 0 top
U257  MURATA_MA40H1S-RMURATA_MA40H1S-R_0_0  [MURATA_MA40H1S-R_0]  127.77,26.66 0 top
U258  MURATA_MA40H1S-RMURATA_MA40H1S-R_0_0  [MURATA_MA40H1S-R_0]  133.24,15.69 0 top
U259  MURATA_MA40H1S-RMURATA_MA40H1S-R_0_0  [MURATA_MA40H1S-R_0]  133.24,21.16 0 top
U260  MURATA_MA40H1S-RMURATA_MA40H1S-R_0_0  [MURATA_MA40H1S-R_0]  127.77,21.16 0 top
U261  MURATA_MA40H1S-RMURATA_MA40H1S-R_0_0  [MURATA_MA40H1S-R_0]  127.77,15.69 0 top
U262  MURATA_MA40H1S-RMURATA_MA40H1S-R_0_0  [MURATA_MA40H1S-R_0]  133.24,59.65 0 top
U263  MURATA_MA40H1S-RMURATA_MA40H1S-R_0_0  [MURATA_MA40H1S-R_0]  133.24,65.13 0 top
U264  MURATA_MA40H1S-RMURATA_MA40H1S-R_0_0  [MURATA_MA40H1S-R_0]  127.77,65.13 0 top
U265  MURATA_MA40H1S-RMURATA_MA40H1S-R_0_0  [MURATA_MA40H1S-R_0]  127.77,59.65 0 top
U266  MURATA_MA40H1S-RMURATA_MA40H1S-R_0_0  [MURATA_MA40H1S-R_0]  133.24,70.63 0 top
U267  MURATA_MA40H1S-RMURATA_MA40H1S-R_0_0  [MURATA_MA40H1S-R_0]  133.24,76.1 0 top
U268  MURATA_MA40H1S-RMURATA_MA40H1S-R_0_0  [MURATA_MA40H1S-R_0]  127.77,76.1 0 top
U269  MURATA_MA40H1S-RMURATA_MA40H1S-R_0_0  [MURATA_MA40H1S-R_0]  127.77,70.63 0 top
U270  MURATA_MA40H1S-RMURATA_MA40H1S-R_0_0  [MURATA_MA40H1S-R_0]  144.21,87.09 0 top
U271  MURATA_MA40H1S-RMURATA_MA40H1S-R_0_0  [MURATA_MA40H1S-R_0]  144.21,92.56 0 top
U272  MURATA_MA40H1S-RMURATA_MA40H1S-R_0_0  [MURATA_MA40H1S-R_0]  138.74,87.09 0 top
U273  MURATA_MA40H1S-RMURATA_MA40H1S-R_0_0  [MURATA_MA40H1S-R_0]  133.24,81.6 0 top
U274  MURATA_MA40H1S-RMURATA_MA40H1S-R_0_0  [MURATA_MA40H1S-R_0]  133.24,87.08 0 top
U275  MURATA_MA40H1S-RMURATA_MA40H1S-R_0_0  [MURATA_MA40H1S-R_0]  127.77,81.6 0 top

## Tracks (layer width: path | path; a pad name or v marks a point on that pad's centre or on a via)
GND  (259 unrouted)
  pour Top: -1.98,110.08 -1.98,38.58 42.11,-5.51 127.45,-5.51 131.52,-1.45 133.86,-1.45 181.84,46.53 181.84,103.38 178.48,106.73 170.56,114.66 166.75,114.66 4.98,114.66 -1.02,108.66
N$1  (via drill 0.35)
  Top 0.152: U3.1 84,40.39 v84,41.78 | v89.33,41.78 89.3,41.75 89.3,40.51 87.75,40.51 U2.1 | U4.1 84,34.91 v84,36.45 | U1.1 89.33,34.91 89.33,36.3 | 89.33,36.3 | 89.33,36.3 v89.33,36.45
  Bottom 0.152: v84,36.45 v89.33,36.45 v89.33,41.78 v84,41.78 v83.99,41.78 80.95,41.78 63,59.73 63,69.48 51.56,80.92 48.92,80.92 39.1,90.74 36.51,90.74 31.14,96.11 31.14,97.94 30.55,98.53 11.35,98.53 J7.2
N$3  (via drill 0.35)
  Top 0.152: U9.1 61.95,56.34 v61.95,57.73 | U10.1 61.95,50.87 v61.95,52.4 | U6.1 67.28,50.87 v67.28,52.4
  Bottom 0.152: v67.28,52.4 v61.95,52.4 | v61.95,52.4 v61.95,57.73 | J5.14 19.38,51.51 19.38,50.9 31.72,38.56 37.67,38.56 39.49,36.73 50.62,36.73 54.58,40.69 56.56,40.69 61.29,45.41 61.29,51.66 61.9,52.27 v61.95,52.4
N$5  (via drill 0.35)
  Top 0.152: U15.1 29,91.06 v29,92.46 | U16.1 29,85.59 v29,87.12 | U14.1 34.34,85.59 v34.34,87.12
  Bottom 0.152: v34.34,87.12 v29,87.12 v29,92.46 28.98,92.51 25.02,96.47 19.53,96.47 J6.2
N$6  (via drill 0.35)
  Top 0.152: U23.1 84,29.39 v84,30.79 | v89.33,30.79 89.3,30.75 89.3,29.52 87.75,29.52 U22.1 | U24.1 84,23.91 v84,25.45 | U21.1 89.33,23.91 v89.33,25.45
  Bottom 0.152: v84,30.79 v89.33,30.79 v89.33,25.45 v84,25.45 83.08,24.54 83.08,17.83 78.66,13.41 76.68,13.41 70.13,6.86 50.31,6.86 48.33,8.84 43.61,8.84 34.31,18.14 27.91,18.14 4.75,41.3 4.75,90.98 6.42,92.66 7.19,92.66 8.41,93.88 9.32,93.88 J7.4
N$7  (via drill 0.35)
  Top 0.152: U27.1 84,18.39 v84,19.79 | v89.33,19.79 89.3,19.76 89.3,18.52 87.75,18.52 U26.1 | U28.1 84,12.92 v84,14.45 | U25.1 89.33,12.92 v89.33,14.45
  Bottom 0.152: v89.33,19.79 v84,19.79 | v89.33,19.79 v89.33,14.45 v84,14.45 | J4.12 165.38,84.98 163.79,84.98 158.21,90.56 158.21,96.59 156.82,97.99 142.26,97.99 142.26,96.1 139.28,96.1 124.26,81.08 121.56,81.08 110.79,70.31 110.79,58.93 90.24,38.38 90.24,20.7 v89.33,19.79
N$8  (via drill 0.35)
  Top 0.152: U31.1 84,7.42 v84,8.81 | v89.33,8.81 89.3,8.78 89.3,7.54 87.75,7.54 U30.1 | U32.1 84,1.94 v84,3.48 | U29.1 89.33,1.94 v89.33,3.48
  Bottom 0.152: v89.33,8.81 v84,8.81 | v89.33,8.81 v89.33,3.48 v84,3.48 | J4.16 166.9,78.49 166.9,79.4 167.97,80.47 167.97,86.56 167.05,87.48 166.29,87.48 165.53,88.24 165.53,91.59 164.61,92.51 163.85,92.51 163.09,93.27 163.09,94.18 164,95.1 164.77,95.1 165.53,95.86 165.53,96.62 166.44,97.54 167.21,97.54 169.8,94.94 169.8,43.74 146.33,20.27 146.33,20.12 142.82,16.61 137.33,16.61 129.56,8.84 124.84,8.84 122.86,6.86 105.33,6.86 100.91,11.28 100.91,20.12 100.61,20.42 94.66,20.42 90.88,16.64 90.88,10.39 89.33,8.84 v89.33,8.81
N$9  (via drill 0.35)
  Top 0.152: U35.1 94.97,40.39 v94.97,41.78 | v100.3,41.78 100.27,41.75 100.27,40.51 98.72,40.51 U34.1 | U36.1 94.97,34.91 v94.97,36.45 | U33.1 100.3,34.91 v100.3,36.45
  Bottom 0.152: v94.97,41.78 v100.3,41.78 v100.3,36.45 | v100.3,36.45 v94.97,36.45 | J4.2 166.75,96.16 166.75,95.4 165.53,94.18 165.53,93.27 166.44,92.35 167.36,92.35 169.19,90.53 169.19,44.04 145.72,20.57 145.72,20.42 143.89,18.59 138.4,18.59 129.71,9.91 124.99,9.91 122.55,7.47 105.64,7.47 101.52,11.58 101.52,35.2 100.3,36.42 v100.3,36.45
N$10  (via drill 0.35)
  Top 0.152: U43.1 94.97,18.39 v94.97,19.79 | v100.3,19.79 100.27,19.76 100.27,18.52 98.72,18.52 U42.1 | U44.1 94.97,12.92 v94.97,14.45 | U41.1 100.3,12.92 v100.3,14.45
  Bottom 0.152: v94.97,19.79 v100.3,19.79 v100.3,14.45 | v100.3,14.45 v94.97,14.45 | J4.10 165.99,86.11 164.61,87.48 163.7,87.48 162.79,88.39 162.79,96.47 164.16,97.84 167.36,97.84 170.71,94.49 170.71,44.2 146.63,20.12 146.63,19.96 142.97,16.31 137.49,16.31 129.71,8.53 124.99,8.53 123.01,6.55 105.18,6.55 100.3,11.43 v100.3,14.45
N$11  (via drill 0.35)
  Top 0.152: U39.1 94.97,29.39 v94.97,30.79 | v100.3,30.79 100.27,30.75 100.27,29.52 98.72,29.52 U38.1 | U40.1 94.97,23.91 v94.97,25.45 | U37.1 100.3,23.91 v100.3,25.45
  Bottom 0.152: v94.97,30.79 v100.3,30.79 v100.3,25.45 | v100.3,25.45 v94.97,25.45 | v100.3,25.45 101.22,24.54 101.22,11.43 105.48,7.16 122.7,7.16 125.14,9.6 129.87,9.6 138.55,18.29 144.04,18.29 146.02,20.27 146.02,20.42 169.49,43.89 169.49,90.68 166.9,93.27 166.9,93.73 J4.4
N$12  (via drill 0.35)
  Top 0.152: U47.1 94.97,7.42 v94.97,8.81 | v100.3,8.81 100.27,8.78 100.27,7.54 98.72,7.54 U46.1 | U48.1 94.97,1.94 v94.97,3.48 | U45.1 100.3,1.94 v100.3,3.48
  Bottom 0.152: v94.97,8.81 v100.3,8.81 v100.3,3.48 v94.97,3.48 94.97,3.35 94.36,2.74 82.42,2.74 82.39,2.77 82.39,9.88 89.61,9.88 90.55,10.82 90.55,38.25 111.1,58.8 111.1,70.18 121.69,80.77 124.38,80.77 139.25,95.64 142.45,95.64 142.57,95.76 142.57,97.69 142.74,97.69 156.69,97.69 157.91,96.47 157.91,88.32 163.4,82.83 163.79,82.44 165.51,82.44 166.75,81.2 166.75,81.08 J4.14
N$13  (via drill 0.35)
  Top 0.152: U51.1 61.95,45.34 v61.95,46.74 | v67.28,46.74 67.25,46.71 67.25,45.47 65.7,45.47 U50.1 | U52.1 61.95,39.87 v61.95,41.4 | U49.1 67.28,39.87 v67.28,41.4
  Bottom 0.152: v61.95,46.74 v67.28,46.74 v67.28,41.4 v61.95,41.4 61.9,41.3 60.98,40.39 54.73,40.39 50.31,35.97 50.31,30.79 45.59,26.06 44.07,26.06 38.58,20.57 28.67,20.57 28.06,21.18 28.06,33.83 14.65,47.24 14.65,50.44 9.78,55.32 9.01,55.32 8.1,56.24 8.1,62.03 9.01,62.94 9.78,62.94 10.54,62.18 10.54,61.27 16.33,55.47 17.09,55.47 18.01,54.56 18.01,51.21 19.23,49.99 19.23,49.07 J5.16
N$14  (via drill 0.35)
  Top 0.152: U55.1 61.95,34.35 v61.95,35.74 | v67.28,35.74 67.25,35.71 67.25,34.47 65.7,34.47 U54.1 | U56.1 61.95,28.87 v61.95,30.4 | U53.1 67.28,28.87 v67.28,30.4
  Bottom 0.152: v67.28,35.74 v61.95,35.74 | v67.28,35.74 v67.28,30.4 v61.95,30.4 | J8.2 9.47,66.75 9.47,69.65 18.16,78.33 18.16,79.1 19.07,80.01 19.84,80.01 28.37,71.48 28.37,64.92 28.83,64.47 38.43,64.47 39.65,65.68 47.72,65.68 54.43,58.98 62.05,58.98 68.3,52.73 68.3,36.73 67.38,35.81 v67.28,35.74
N$15  (via drill 0.35)
  Top 0.152: U59.1 61.95,23.35 v61.95,24.74 | v67.28,24.74 67.25,24.71 67.25,23.47 65.7,23.47 U58.1 | U60.1 61.95,17.87 v61.95,19.41 | U57.1 67.28,17.87 v67.28,19.41
  Bottom 0.152: v61.95,24.74 v67.28,24.74 67.28,20.42 | 67.28,20.42 v67.28,19.41 v61.95,19.41 | 67.28,20.42 78.66,20.42 78.97,20.12 78.97,14.17 78.51,13.72 76.53,13.72 69.97,7.16 50.47,7.16 48.49,9.14 43.76,9.14 34.47,18.44 28.06,18.44 5.05,41.45 5.05,88.85 6.27,90.07 9.78,90.07 10.54,89.31 10.54,88.39 9.78,87.63 9.01,87.63 8.1,86.72 8.1,80.92 9.32,79.7 9.32,78.79 J7.16
N$16  (via drill 0.35)
  Top 0.152: U63.1 61.95,12.38 v61.95,13.77 | v67.28,13.77 67.25,13.74 67.25,12.5 65.7,12.5 U62.1 | U64.1 61.95,6.9 v61.95,8.43 | U61.1 67.28,6.9 v67.28,8.43
  Bottom 0.152: v61.95,13.77 v67.28,13.77 v67.28,8.43 v61.95,8.43 61.29,7.77 50.77,7.77 48.79,9.75 44.07,9.75 34.77,19.05 28.37,19.05 5.66,41.76 5.66,67.21 10.54,72.08 10.54,79.25 9.47,80.31 9.47,81.23 J7.14
N$18  (via drill 0.35)
  Top 0.152: U71.1 73.02,29.39 v73.02,30.79 | v78.36,30.79 78.33,30.75 78.33,29.52 76.77,29.52 U70.1 | U72.1 73.02,23.91 v73.02,25.45 | U69.1 78.36,23.91 v78.36,25.45
  Bottom 0.152: v78.36,30.79 v73.02,30.79 | v78.36,30.79 v78.36,25.45 v73.02,25.45 | v78.36,30.79 78.97,31.39 78.97,42.98 62.56,59.38 62.56,69.44 51.38,80.62 48.79,80.62 38.97,90.44 36.08,90.44 30.48,96.04 30.48,97.99 16.63,97.99 15.41,96.77 15.41,92.81 9.47,86.87 9.47,86.41 J7.10
N$19  (via drill 0.35)
  Top 0.152: U12.1 49.18,78.26 50.98,78.26 v50.98,79.7 | U13.1 49.18,72.78 50.98,72.78 v50.98,74.37 | U11.1 56.31,72.84 v56.31,74.37
  Bottom 0.152: v56.31,74.37 v50.98,74.37 v50.98,79.7 50.92,79.7 41.02,79.7 38.58,82.14 32.64,82.14 22.12,92.66 18.92,92.66 18.16,91.9 18.16,88.54 19.38,87.33 19.38,86.41 J6.10
N$20  (via drill 0.35)
  Top 0.152: U79.1 73.02,7.42 v73.02,8.81 | v78.36,8.81 78.33,8.78 78.33,7.54 76.77,7.54 U78.1 | U80.1 73.02,1.94 v73.02,3.48 | U77.1 78.36,1.94 v78.36,3.48
  Bottom 0.152: v73.02,3.48 v78.36,3.48 v78.36,8.81 v73.02,8.81 73.02,8.69 70.89,6.55 50.16,6.55 48.18,8.53 43.46,8.53 34.16,17.83 27.76,17.83 4.44,41.15 4.44,93.27 6.42,95.25 9.78,95.25 10.54,94.49 10.54,93.57 9.47,92.51 9.47,91.44 J7.6
N$24  (via drill 0.35)
  Top 0.152: U94.1 49.18,45.29 50.98,45.29 v50.98,46.74 | v56.31,46.74 56.28,46.71 56.28,45.47 54.73,45.47 U93.1 | U95.1 49.18,39.82 50.98,39.82 v50.98,41.4 | U92.1 56.31,39.87 v56.31,41.4
  Bottom 0.152: v50.98,46.74 v56.31,46.74 v56.31,41.4 v50.98,41.4 50.92,41.3 46.66,37.03 39.65,37.03 37.82,38.86 31.87,38.86 28.06,42.67 28.06,44.5 19.38,53.19 19.38,53.95 J5.12
N$25  (via drill 0.35)
  Top 0.152: U98.1 49.18,34.3 50.98,34.3 v50.98,35.74 | v56.31,35.74 56.28,35.71 56.28,34.47 54.73,34.47 U97.1 | U99.1 49.18,28.82 50.98,28.82 v50.98,30.4 | U96.1 56.31,28.87 v56.31,30.4
  Bottom 0.152: v56.31,35.74 v50.98,35.74 | v56.31,35.74 v56.31,30.4 v50.98,30.4 | J8.4 9.47,64.31 12.67,64.31 16.33,67.97 24.41,67.97 32.18,60.2 38.58,60.2 40.1,58.67 61.9,58.67 67.99,52.58 67.99,41.15 63.27,36.42 57.02,36.42 56.41,35.81 v56.31,35.74
N$26  (via drill 0.35)
  Top 0.152: U102.1 49.18,23.3 50.98,23.3 v50.98,24.74 | v56.31,24.74 56.28,24.71 56.28,23.47 54.73,23.47 U101.1 | U103.1 49.18,17.82 50.98,17.82 v50.98,19.41 | U100.1 56.31,17.87 v56.31,19.41
  Bottom 0.152: J8.14 9.47,51.51 9.47,50.44 27.45,32.46 27.45,20.88 28.67,19.66 35.08,19.66 39.65,15.09 46.66,15.09 v50.98,19.41 v56.31,19.41 v56.31,24.74 56.04,25.01 51.17,25.01 50.98,24.82 v50.98,24.74
N$27  (via drill 0.35)
  Top 0.152: U106.1 49.18,12.32 50.98,12.32 v50.98,13.77 | v56.31,13.77 56.28,13.74 56.28,12.5 54.73,12.5 U105.1 | U107.1 50.98,6.9 v50.98,8.43 | U104.1 56.31,6.9 v56.31,8.43
  Bottom 0.152: v50.98,8.43 v56.31,8.43 v56.31,13.77 v50.98,13.77 v50.97,13.77 40.51,13.77 34.92,19.36 28.52,19.36 9.47,38.41 9.47,48.92 J8.16
N$28  (via drill 0.35)
  Top 0.152: U110.1 49.18,56.29 50.98,56.29 v50.98,57.73 | v56.31,57.73 56.28,57.7 56.28,56.46 54.73,56.46 U109.1 | U111.1 49.18,50.81 50.98,50.81 v50.98,52.4 | U108.1 56.31,50.87 v56.31,52.4
  Bottom 0.152: v50.98,57.73 v56.31,57.73 v56.31,52.4 v50.98,52.4 50.92,52.27 46.66,48.01 39.8,48.01 38.58,49.23 32.64,49.23 20.29,61.57 19.38,61.57 J5.6
N$29  (via drill 0.35)
  Top 0.152: U114.1 49.18,67.26 50.98,67.26 v50.98,68.71 | v56.31,68.71 56.28,68.68 56.28,67.44 54.73,67.44 U113.1 | U115.1 49.18,61.79 50.98,61.79 v50.98,63.37 | U112.1 56.31,61.84 v56.31,63.37
  Bottom 0.152: v50.98,63.37 v56.31,63.37 v56.31,68.71 v50.98,68.71 50.95,68.71 50.92,68.73 41.02,68.73 38.58,71.17 32.64,71.17 28.06,75.74 28.06,76.81 19.84,85.04 18.92,85.04 18.16,84.28 18.16,83.52 19.38,82.3 19.38,81.38 J6.14
N$30  (via drill 0.35)
  Top 0.152: U116.1 105.94,45.4 v105.94,46.79 | v111.28,46.79 111.25,46.76 111.25,45.52 109.69,45.52 U91.1 | U117.1 105.94,39.92 v105.94,41.45 | U90.1 111.28,39.92 v111.28,41.45
  Bottom 0.152: v105.94,46.79 v111.28,46.79 v111.28,41.45 v105.94,41.45 105.33,40.84 105.33,30.18 109.45,26.06 133.52,26.06 135.2,27.74 140.69,27.74 144.8,31.85 144.8,32 157.6,44.81 157.6,51.51 163.7,57.61 164.46,57.61 165.38,58.52 165.38,59.28 166.29,60.2 167.05,60.2 168.58,61.72 168.58,86.41 166.9,88.09 166.9,88.54 J4.8
N$31  (via drill 0.35)
  Top 0.152: U121.1 39.98,52.63 v39.98,54.03 | v45.31,54.03 45.28,54 45.28,52.76 43.73,52.76 U120.1 | U122.1 39.98,47.16 v39.98,48.69 | U119.1 45.31,47.16 v45.31,48.69
  Bottom 0.152: v39.98,48.69 v45.31,48.69 v45.31,54.03 v39.98,54.03 39.95,53.95 39.49,53.49 28.83,53.49 28.37,53.95 28.37,54.25 19.38,63.25 19.38,64.16 J5.4
N$32  (via drill 0.35)
  Top 0.152: U125.1 39.98,41.64 v39.98,43.03 | v45.31,43.03 45.28,43 45.28,41.76 43.73,41.76 U124.1 | U126.1 39.98,36.16 v39.98,37.69 | U123.1 45.31,36.16 v45.31,37.69
  Bottom 0.152: v39.98,37.69 v45.31,37.69 v45.31,43.03 v39.98,43.03 39.95,42.98 39.49,42.52 28.67,42.52 28.37,42.82 28.37,46.63 19.38,55.63 19.38,56.54 J5.10
N$33  (via drill 0.35)
  Top 0.152: U129.1 39.98,30.64 v39.98,32.03 | v45.31,32.03 45.28,32 45.28,30.76 43.73,30.76 U128.1 | U130.1 39.98,25.16 v39.98,26.7 | U127.1 45.31,25.16 v45.31,26.7
  Bottom 0.152: v39.98,26.7 v45.31,26.7 v45.31,32.03 v39.98,32.03 39.95,32.16 39.95,32.77 34.47,38.25 28.37,38.25 18.16,48.46 18.16,49.23 17.24,50.14 16.48,50.14 15.57,51.05 15.57,54.56 9.47,60.66 9.47,61.57 J8.6
N$34  (via drill 0.35)
  Top 0.152: U133.1 39.98,19.66 v39.98,21.06 | v45.31,21.06 45.28,21.03 45.28,19.79 43.73,19.79 U132.1 | U134.1 39.98,14.19 v39.98,15.72 | U131.1 45.31,14.19 v45.31,15.72
  Bottom 0.152: v39.98,15.72 v45.31,15.72 v45.31,21.06 v39.98,21.06 39.19,20.27 28.52,20.27 27.76,21.03 27.76,33.68 14.35,47.09 14.35,48.16 9.47,53.03 9.47,53.95 J8.12
N$35  (via drill 0.35)
  Top 0.152: U137.1 39.98,63.63 v39.98,65.02 | v45.31,65.02 45.28,65 45.28,63.75 43.73,63.75 U136.1 | U138.1 39.98,58.16 v39.98,59.69 | U135.1 45.31,58.16 v45.31,59.69
  Bottom 0.152: v39.98,59.69 v45.31,59.69 v45.31,65.02 v39.98,65.02 39.95,64.92 39.19,64.16 28.67,64.16 19.53,73.3 19.53,78.64 J6.16
N$36  (via drill 0.35)
  Top 0.152: U141.1 39.98,74.61 v39.98,76 | v45.31,76 45.28,75.97 45.28,74.73 43.73,74.73 U140.1 | U142.1 39.98,69.13 v39.98,70.66 | U139.1 45.31,69.13 v45.31,70.66
  Bottom 0.152: v39.98,70.66 v45.31,70.66 45.31,73.76 v45.31,76 v39.98,76 39.95,75.89 39.49,75.44 28.83,75.44 28.37,75.89 28.37,79.1 19.53,87.94 19.53,88.85 J6.8
N$37  (via drill 0.35)
  Top 0.152: U145.1 29,58.12 v29,59.51 | v34.34,59.51 34.31,59.48 34.31,58.24 32.75,58.24 U144.1 | U149.1 29,52.64 v29,54.18 | U143.1 34.34,52.64 v34.34,54.18
  Bottom 0.152: v29,54.18 v34.34,54.18 v34.34,59.51 v29,59.51 28.98,59.59 21.82,66.75 19.38,66.75 J5.2
N$38  (via drill 0.35)
  Top 0.152: U147.1 39.98,85.58 v39.98,86.97 | U148.1 39.98,80.1 v39.98,81.64 | U146.1 45.31,80.1 v45.31,81.64
  Bottom 0.152: v45.31,81.64 v39.98,81.64 39.98,86.41 | 39.98,86.41 v39.98,86.97 | 39.98,86.41 28.83,86.41 21.36,93.88 19.53,93.88 J6.4
N$39  (via drill 0.35)
  Top 0.152: U152.1 29,47.12 v29,48.51 | v34.34,48.51 34.31,48.48 34.31,47.24 32.75,47.24 U151.1 | U153.1 29,41.65 v29,43.18 | U150.1 34.34,41.65 v34.34,43.18
  Bottom 0.152: v29,43.18 v34.34,43.18 v34.34,48.51 v29,48.51 28.98,48.62 19.38,58.22 19.38,59.13 19.35,59.16 J5.8
N$40  (via drill 0.35)
  Top 0.152: U156.1 29,36.12 v29,37.52 | v34.34,37.52 34.31,37.49 34.31,36.25 32.75,36.25 U155.1 | U157.1 29,30.65 v29,32.18 | U154.1 34.34,30.65 v34.34,32.18
  Bottom 0.152: v29,32.18 v34.34,32.18 v34.34,37.52 v29,37.52 28.98,37.64 26.54,37.64 15.26,48.92 15.26,52.27 9.47,58.06 9.47,59.13 J8.8
N$41  (via drill 0.35)
  Top 0.152: U160.1 29,25.15 v29,26.54 | v34.34,26.54 34.31,26.51 34.31,25.27 32.75,25.27 U159.1 | U161.1 29,19.67 v29,21.21 | U158.1 34.34,19.67 v34.34,21.21
  Bottom 0.152: v29,21.21 v34.34,21.21 v34.34,26.54 v29,26.54 28.98,26.67 28.37,27.28 28.37,33.98 14.96,47.4 14.96,50.6 9.47,56.08 9.47,56.54 J8.10
N$42  (via drill 0.35)
  Top 0.152: U164.1 29,69.12 v29,70.51 | v34.34,70.51 34.31,70.48 34.31,69.24 32.75,69.24 U163.1 | U165.1 29,63.64 v29,65.18 | U162.1 34.34,63.64 v34.34,65.18
  Bottom 0.152: v29,65.18 v34.34,65.18 v34.34,70.51 v29,70.51 28.98,70.56 28.98,73.46 19.53,82.91 19.53,83.82 J6.12
N$43  (via drill 0.35)
  Top 0.152: U168.1 29,80.09 v29,81.48 | v34.34,81.48 34.31,81.45 34.31,80.21 32.75,80.21 U167.1 | U169.1 29,74.61 v29,76.15 | U166.1 34.34,74.61 v34.34,76.15
  Bottom 0.152: v29,76.15 v34.34,76.15 v34.34,81.48 v29,81.48 28.98,81.53 19.53,90.98 19.53,91.44 J6.6
N$44  (via drill 0.35)
  Top 0.152: U171.1 105.94,34.4 v105.94,35.79 | v111.28,35.79 111.25,35.76 111.25,34.52 109.69,34.52 U170.1 | U172.1 105.94,28.92 v105.94,30.45 | U118.1 111.28,28.92 v111.28,30.45
  Bottom 0.152: v111.28,35.79 v105.94,35.79 | v111.28,35.79 v111.28,30.45 v105.94,30.45 | J3.4 165.83,64.01 164.61,65.23 145.26,65.23 140.23,60.2 134.74,60.2 129.26,54.71 125.45,54.71 118.13,47.4 116.61,47.4 111.88,42.67 111.88,36.42 111.28,35.81 v111.28,35.79
N$45  (via drill 0.35)
  Top 0.152: U175.1 105.94,23.4 v105.94,24.79 | v111.28,24.79 111.25,24.76 111.25,23.52 109.69,23.52 U174.1 | U176.1 105.94,17.92 v105.94,19.46 | U173.1 111.28,17.92 v111.28,19.46
  Bottom 0.152: v105.94,19.46 v111.28,19.46 v111.28,24.79 v105.94,24.79 105.94,24.84 105.03,25.76 105.03,46.79 105.64,47.4 107.16,47.4 111.88,52.12 111.88,70.26 122.09,80.47 124.53,80.47 139.35,95.29 142.88,95.29 143.02,95.43 143.02,97.38 156.54,97.38 157.6,96.32 157.6,83.52 168.27,72.85 168.27,63.4 166.75,61.87 166.75,61.57 J3.6
N$46  (via drill 0.35)
  Top 0.152: U179.1 105.94,12.43 v105.94,13.82 | v111.28,13.82 111.25,13.79 111.25,12.55 109.69,12.55 U178.1 | U180.1 105.94,6.95 v105.94,8.48 | U177.1 111.28,6.95 v111.28,8.48
  Bottom 0.152: v111.28,13.82 v105.94,13.82 | v111.28,13.82 v111.28,8.48 v105.94,8.48 | J3.10 165.83,56.39 164.46,55.02 163.7,55.02 157.91,49.23 157.91,44.65 145.11,31.85 145.11,31.7 140.84,27.43 135.35,27.43 133.37,25.45 116.61,25.45 111.88,20.73 111.88,14.48 111.28,13.87 v111.28,13.82
N$47  (via drill 0.35)
  Top 0.152: U75.1 73.02,18.39 v73.02,19.79 | v78.36,19.79 78.33,19.76 78.33,18.52 76.77,18.52 U74.1 | U76.1 73.02,12.92 v73.02,14.45 | U73.1 78.36,12.92 v78.36,14.45
  Bottom 0.152: v73.02,19.79 v78.36,19.79 v78.36,14.45 v73.02,14.45 73.02,13.26 67.23,7.47 50.62,7.47 48.64,9.45 43.91,9.45 34.62,18.75 28.22,18.75 5.36,41.6 5.36,86.56 6.42,87.63 7.19,87.63 8.41,88.85 9.32,88.85 J7.8
N$48  (via drill 0.35)
  Top 0.152: v111.28,57.76 111.25,57.73 111.25,56.49 109.69,56.49 U185.1 | U186.1 105.94,50.89 v105.94,52.43 | U184.1 111.28,50.89 v111.28,52.43
  Bottom 0.152: v111.28,57.76 v111.28,52.43 v105.94,52.43 104.72,51.21 104.72,8.84 105.79,7.77 122.4,7.77 124.84,10.21 129.56,10.21 138.25,18.9 143.74,18.9 145.41,20.57 145.41,20.73 168.88,44.2 168.88,88.24 166.9,90.22 166.9,91.14 J4.6
N$50  (via drill 0.35)
  Top 0.152: U194.1 116.91,45.4 v116.91,46.79 | v122.25,46.79 122.22,46.76 122.22,45.52 120.66,45.52 U193.1 | U195.1 116.91,39.92 v116.91,41.45 | U192.1 122.25,39.92 v122.25,41.45
  Bottom 0.152: v122.25,46.79 v116.91,46.79 | v122.25,46.79 v122.25,41.45 v116.91,41.45 | v122.25,46.79 132.31,46.79 135.05,49.53 140.99,49.53 149.07,57.61 153.95,57.61 155.17,58.83 156.08,58.83 J2.8
N$51  (via drill 0.35)
  Top 0.152: U198.1 116.91,34.4 v116.91,35.79 | v122.25,35.79 122.22,35.76 122.22,34.52 120.66,34.52 U197.1 | U199.1 116.91,28.92 v116.91,30.45 | U196.1 122.25,28.92 v122.25,30.45
  Bottom 0.152: v122.25,35.79 v116.91,35.79 | v122.25,35.79 v122.25,30.45 v116.91,30.45 | J2.14 156.08,51.21 155.17,51.21 153.95,49.99 151.97,49.99 140.38,38.41 134.9,38.41 132.31,35.81 122.25,35.81 v122.25,35.79
N$52  (via drill 0.35)
  Top 0.152: U202.1 116.91,23.4 v116.91,24.79 | v122.25,24.79 122.22,24.76 122.22,23.52 120.66,23.52 U201.1 | U203.1 116.91,17.92 v116.91,19.46 | U200.1 122.25,17.92 v122.25,19.46
  Bottom 0.152: v116.91,24.79 v122.25,24.79 v122.25,19.46 | v122.25,19.46 v116.91,19.46 | J3.8 166.75,58.83 166.75,58.06 167.97,56.84 167.97,55.93 167.05,55.02 166.14,55.02 165.53,54.41 165.53,53.34 166.29,52.58 167.05,52.58 167.97,51.66 167.97,44.2 144.8,21.03 144.8,20.88 143.43,19.51 137.94,19.51 133.52,15.09 126.52,15.09 122.25,19.36 v122.25,19.46
N$53  (via drill 0.35)
  Top 0.152: U206.1 116.91,12.43 v116.91,13.82 | v122.25,13.82 122.22,13.79 122.22,12.55 120.66,12.55 U205.1 | U207.1 116.91,6.95 v116.91,8.48 | U204.1 122.25,6.95 v122.25,8.48
  Bottom 0.152: v122.25,13.82 v116.91,13.82 | v122.25,13.82 v122.25,8.48 v116.91,8.48 | J3.12 166.75,53.8 166.75,53.34 168.27,51.82 168.27,44.04 145.11,20.88 145.11,20.73 143.58,19.2 138.1,19.2 132.76,13.87 122.25,13.87 v122.25,13.82
N$54  (via drill 0.35)
  Top 0.152: U210.1 116.91,56.39 v116.91,57.78 | v122.25,57.78 122.22,57.76 122.22,56.52 120.66,56.52 U209.1 | U211.1 116.91,50.92 v116.91,52.45 | U208.1 122.25,50.92 v122.25,52.45
  Bottom 0.152: v116.91,52.45 v122.25,52.45 v122.25,57.78 v116.91,57.78 116.91,57.91 116.3,58.52 116.3,69.04 116.76,69.49 133.07,69.49 135.35,71.78 140.84,71.78 148.61,79.55 153.79,79.55 155.17,80.92 J1.14
N$55  (via drill 0.35)
  Top 0.152: U214.1 116.91,67.37 v116.91,68.76 | v122.25,68.76 122.22,68.73 122.22,67.49 120.66,67.49 U213.1 | U215.1 116.91,61.89 v116.91,63.42 | U212.1 122.25,61.89 v122.25,63.42
  Bottom 0.152: v122.25,68.76 v116.91,68.76 | v122.25,68.76 v122.25,63.42 v116.91,63.42 | J1.8 156.23,88.54 156.23,87.48 157.3,86.41 157.3,80.47 156.38,79.55 155.62,79.55 154.71,78.64 154.71,77.88 148.31,71.48 135.51,71.48 132.92,68.89 122.25,68.89 v122.25,68.76
N$56  (via drill 0.35)
  Top 0.152: U218.1 138.86,58.09 v138.86,59.49 | v144.19,59.49 144.16,59.46 144.16,58.22 142.61,58.22 U217.1 | U222.1 138.86,52.62 v138.86,54.15 | U216.1 144.19,52.62 v144.19,54.15
  Bottom 0.152: v144.19,59.49 v138.86,59.49 | v144.19,59.49 v144.19,54.15 v138.86,54.15 | J2.4 155.17,64.01 153.79,62.64 147.24,62.64 144.19,59.59 v144.19,59.49
N$57  (via drill 0.35)
  Top 0.152: v122.25,79.73 122.22,79.7 122.22,78.46 120.66,78.46 U220.1 | U221.1 116.91,72.86 v116.91,74.4 | U219.1 122.25,72.86 v122.25,74.4
  Bottom 0.152: v116.91,74.4 v122.25,74.4 v122.25,79.73 122.25,79.86 132.46,79.86 135.05,82.45 140.99,82.45 148.31,89.76 153.95,89.76 155.17,90.98 156.08,90.98 J1.6
N$58  (via drill 0.35)
  Top 0.152: U225.1 138.86,47.1 v138.86,48.49 | v144.19,48.49 144.16,48.46 144.16,47.22 142.61,47.22 U224.1 | U226.1 138.86,41.62 v138.86,43.16 | U223.1 144.19,41.62 v144.19,43.16
  Bottom 0.152: v144.19,48.49 v138.86,48.49 | v144.19,48.49 v144.19,43.16 v138.86,43.16 | J2.12 156.08,53.8 155.17,53.8 153.95,52.58 148.16,52.58 144.19,48.62 v144.19,48.49
N$59  (via drill 0.35)
  Top 0.152: U229.1 138.86,36.1 v138.86,37.49 | v144.19,37.49 144.16,37.46 144.16,36.22 142.61,36.22 U228.1 | U230.1 138.86,30.62 v138.86,32.16 | U227.1 144.19,30.62 v144.19,32.16
  Bottom 0.152: v144.19,37.49 v138.86,37.49 | v144.19,37.49 v144.19,32.16 v138.86,32.16 | v144.19,37.49 146.48,37.49 157.3,48.31 157.3,53.8 163.7,60.2 164.61,60.2 165.38,60.96 165.38,61.87 166.14,62.64 167.05,62.64 167.97,63.55 167.97,64.47 166.75,65.68 166.75,66.45 J3.2
N$60  (via drill 0.35)
  Top 0.152: U233.1 138.86,25.13 v138.86,26.52 | v144.19,26.52 144.16,26.49 144.16,25.25 142.61,25.25 U232.1 | U234.1 138.86,19.65 v138.86,21.18 | U231.1 144.19,19.65 v144.19,21.18
  Bottom 0.152: v138.86,26.52 v144.19,26.52 144.19,26.36 | 144.19,26.36 v144.19,21.18 v138.86,21.18 | 144.19,26.36 166.6,48.77 J3.16
N$61  (via drill 0.35)
  Top 0.152: U237.1 138.86,69.09 v138.86,70.48 | v144.19,70.48 144.16,70.46 144.16,69.22 142.61,69.22 U236.1 | U238.1 138.86,63.62 v138.86,65.15 | U235.1 144.19,63.62 v144.19,65.15
  Bottom 0.152: v138.86,70.48 v144.19,70.48 144.19,67.82 | 144.19,67.82 v144.19,65.15 v138.86,65.15 | 144.19,67.82 153.95,67.82 155.17,66.6 156.08,66.6 J2.2
N$62  (via drill 0.35)
  Top 0.152: U241.1 138.86,80.07 v138.86,81.46 | v144.19,81.46 144.16,81.43 144.16,80.19 142.61,80.19 U240.1 | U242.1 138.86,74.59 v138.86,76.12 | U239.1 144.19,74.59 v144.19,76.12
  Bottom 0.152: v144.19,81.46 v138.86,81.46 | v144.19,81.46 v144.19,76.12 v138.86,76.12 | J1.12 156.08,83.36 155.17,83.36 153.95,82.14 144.8,82.14 144.19,81.53 v144.19,81.46
N$64  (via drill 0.35)
  Top 0.152: U248.1 127.89,52.61 v127.89,54 | v133.22,54 133.19,53.97 133.19,52.73 131.64,52.73 U247.1 | U249.1 127.89,47.13 v127.89,48.67 | U246.1 133.22,47.13 v133.22,48.67
  Bottom 0.152: v127.89,54 v133.22,54 133.22,53.49 | 133.22,53.49 v133.22,48.67 v127.89,48.67 | 133.22,53.49 144.5,53.49 151.2,60.2 153.95,60.2 155.17,61.42 156.08,61.42 J2.6
N$65  (via drill 0.35)
  Top 0.152: U252.1 127.89,41.61 v127.89,43 | v133.22,43 133.19,42.97 133.19,41.73 131.64,41.73 U251.1 | U253.1 127.89,36.13 v127.89,37.67 | U250.1 133.22,36.13 v133.22,37.67
  Bottom 0.152: v133.22,43 v127.89,43 | v133.22,43 v133.22,37.67 v127.89,37.67 | J2.10 155.17,56.39 153.79,55.02 146.94,55.02 141.14,49.23 138.71,49.23 133.22,43.74 v133.22,43
N$66  (via drill 0.35)
  Top 0.152: U256.1 127.89,30.61 v127.89,32 | v133.22,32 133.19,31.98 133.19,30.73 131.64,30.73 U255.1 | U257.1 127.89,25.14 v127.89,26.67 | U254.1 133.22,25.14 v133.22,26.67
  Bottom 0.152: v133.22,32 v127.89,32 | v133.22,32 v133.22,26.67 v127.89,26.67 | J2.16 155.17,48.77 144.5,38.1 138.55,38.1 133.22,32.77 v133.22,32
N$67  (via drill 0.35)
  Top 0.152: U260.1 127.89,19.64 v127.89,21.03 | v133.22,21.03 133.19,21 133.19,19.76 131.64,19.76 U259.1 | U261.1 127.89,14.16 v127.89,15.7 | U258.1 133.22,14.16 v133.22,15.7
  Bottom 0.152: v133.22,21.03 v127.89,21.03 | v133.22,21.03 v133.22,15.7 v127.89,15.7 | v133.22,21.03 133.22,21.79 138.55,27.13 140.99,27.13 145.41,31.55 145.41,31.7 163.7,49.99 164.46,49.99 165.68,51.21 166.6,51.21 J3.14
N$68  (via drill 0.35)
  Top 0.152: U264.1 127.89,63.61 v127.89,65 | v133.22,65 133.19,64.97 133.19,63.73 131.64,63.73 U263.1 | U265.1 127.89,58.13 v127.89,59.66 | U262.1 133.22,58.13 v133.22,59.66
  Bottom 0.152: v133.22,65 v127.89,65 | v133.22,65 v133.22,59.66 v127.89,59.66 | v133.22,65 133.22,65.84 138.55,71.17 148.46,71.17 155.62,78.33 156.08,78.33 J1.16
N$69  (via drill 0.35)
  Top 0.152: U268.1 127.89,74.58 v127.89,75.97 | v133.22,75.97 133.19,75.94 133.19,74.7 131.64,74.7 U267.1 | U269.1 127.89,69.1 v127.89,70.64 | U266.1 133.22,69.1 v133.22,70.64
  Bottom 0.152: v133.22,75.97 v127.89,75.97 | v133.22,75.97 v133.22,70.64 v127.89,70.64 | v133.22,75.97 133.22,76.81 138.55,82.14 141.14,82.14 143.74,84.73 153.95,84.73 155.17,85.95 156.08,85.95 J1.10
N$70  (via drill 0.35)
  Top 0.152: v144.19,92.43 144.16,92.4 144.16,91.16 142.61,91.16 U271.1 | U272.1 138.86,85.56 v138.86,87.1 | U270.1 144.19,85.56 v144.19,87.1
  Bottom 0.152: v138.86,87.1 v144.19,87.1 v144.19,92.43 144.19,92.51 146.48,94.79 153.79,94.79 155.17,96.16 J1.2
N$71  (via drill 0.35)
  Top 0.152: v133.22,86.94 133.19,86.92 133.19,85.67 131.64,85.67 U274.1 | U275.1 127.89,80.08 v127.89,81.61 | U273.1 133.22,80.08 v133.22,81.61
  Bottom 0.152: v133.22,86.94 133.22,86.41 | 133.22,86.41 v133.22,81.61 v127.89,81.61 | 133.22,86.41 144.5,86.41 150.44,92.35 153.95,92.35 155.17,93.57 156.08,93.57 J1.4
N$74  (via drill 0.35)
  Top 0.152: U67.1 73.02,40.39 v73.02,41.78 | v78.36,41.78 78.33,41.75 78.33,40.51 76.77,40.51 U66.1 | U68.1 73.02,34.91 v73.02,36.45 | U65.1 78.36,34.91 v78.36,36.45
  Bottom 0.152: v73.02,36.45 v78.36,36.45 v78.36,41.78 v73.02,41.78 73.02,48.46 62.25,59.23 62.25,69.29 51.23,80.31 48.64,80.31 39.02,89.93 35.8,89.93 29.79,95.94 29.79,97.69 18.92,97.69 18.16,96.93 18.16,96.16 17.4,95.4 16.63,95.4 15.72,94.49 15.72,91.14 9.47,84.89 9.47,83.82 J7.12